# EAGLE schematic TransientsWiring (EAGLE 9.6.2)
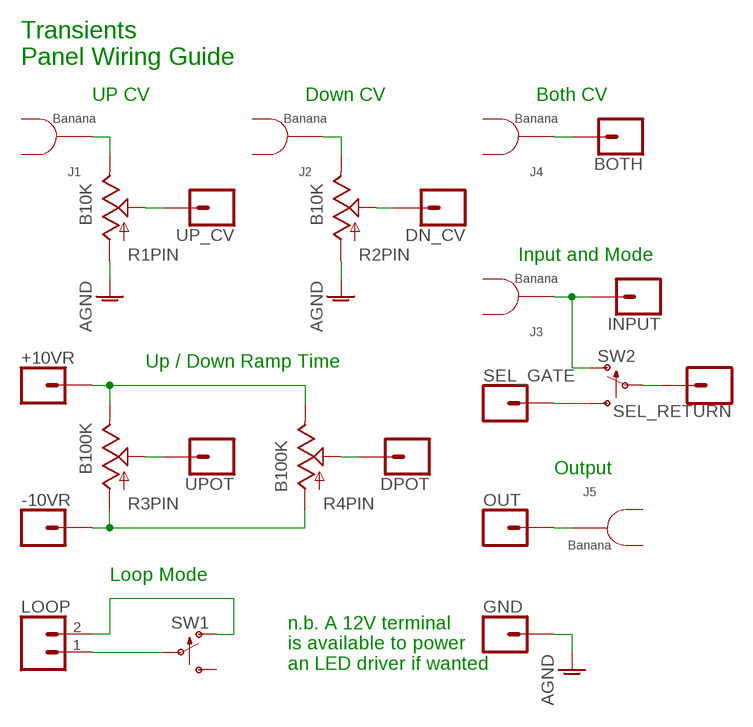
[diagram p0: schematic, sheet 1]

## Parts
+10VR  1XWIREPAD  [1X01]
-10VR  1XWIREPAD  [1X01]
BOTH  1XWIREPAD  [1X01]
DN_CV  1XWIREPAD  [1X01]
DPOT  1XWIREPAD  [1X01]
GND  1XWIREPAD  [1X01]
INPUT  1XWIREPAD  [1X01]
J1  BANANA_SOCKET_PAD  [BANANA_PCB_PAD]
J2  BANANA_SOCKET_PAD  [BANANA_PCB_PAD]
J3  BANANA_SOCKET_PAD  [BANANA_PCB_PAD]
J4  BANANA_SOCKET_PAD  [BANANA_PCB_PAD]
J5  BANANA_SOCKET_PAD  [BANANA_PCB_PAD]
LOOP  2XWIREPAD  [1X02]
OUT  1XWIREPAD  [1X01]
R1  B10K  POTENTIOMETER  [ALPHA_RV09_9MMPOT]
R2  B10K  POTENTIOMETER  [ALPHA_RV09_9MMPOT]
R3  B100K  POTENTIOMETER  [ALPHA_RV09_9MMPOT]
R4  B100K  POTENTIOMETER  [ALPHA_RV09_9MMPOT]
SEL_GATE  1XWIREPAD  [1X01]
SEL_RETURN  1XWIREPAD  [1X01]
SW1  SPDT_SWITCHDW1  [MICRODPDT-DW1]
SW2  SPDT_SWITCHDW1  [MICRODPDT-DW1]
UP_CV  1XWIREPAD  [1X01]
UPOT  1XWIREPAD  [1X01]

## Nets
AGND: GND.1 R1.C1(PIN:A) R2.C1(PIN:A)
N$1: J1.P$2 R1.C3(PIN:B)
N$2: R1.C2(PIN:W) UP_CV.1
N$3: J2.P$2 R2.C3(PIN:B)
N$4: DN_CV.1 R2.C2(PIN:W)
N$5: +10VR.1 R3.C3(PIN:B) R4.C3(PIN:B)
N$6: -10VR.1 R3.C1(PIN:A) R4.C1(PIN:A)
N$7: R3.C2(PIN:W) UPOT.1
N$8: DPOT.1 R4.C2(PIN:W)
N$9: LOOP.1 SW1.C2(P)
N$10: LOOP.2 SW1.C1(O)
N$11: SEL_GATE.1 SW2.C3(S)
N$12: SEL_RETURN.1 SW2.C2(P)
N$13: INPUT.1 J3.P$2 SW2.C1(O)
N$14: BOTH.1 J4.P$2
N$15: J5.P$2 OUT.1
Unconnected: R1.LUGL R1.LUGR R2.LUGL R2.LUGR R3.LUGL R3.LUGR R4.LUGL R4.LUGR SW1.C3(S)

## Notes on the sheet
- Transients 
  Panel Wiring Guide
- UP CV | Down CV | Both CV
- Input and Mode
- Up / Down Ramp Time
- Output
- Loop Mode
- n.b. A 12V terminal 
  is available to power 
  an LED driver if wanted

## Library data of the parts
+10VR -10VR BOTH DN_CV DPOT GND INPUT OUT SEL_GATE SEL_RETURN UP_CV UPOT = ElectricNoodleBox:1XWIREPAD
J1-J5 = ElectricNoodleBox:BANANA_SOCKET_PAD
LOOP = ElectricNoodleBox:2XWIREPAD
R1-R4 = ElectricNoodleBox:POTENTIOMETER
SW1 SW2 = ElectricNoodleBox:SPDT_SWITCH